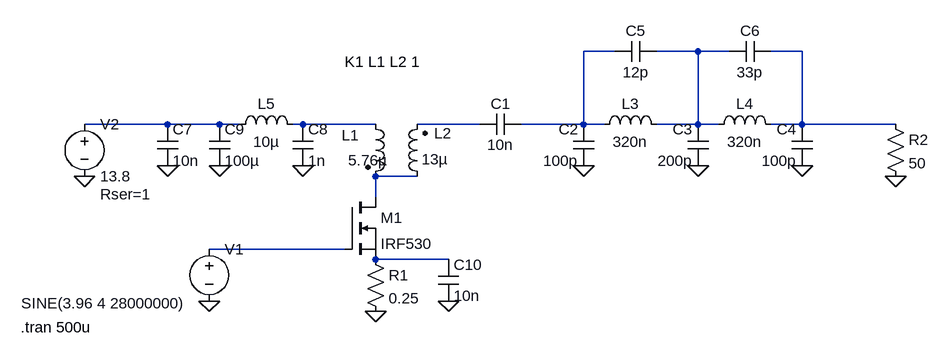
[diagram p0: schematic usdx_mOnO_PA_IRF530.asc]
usdx_mOnO_PA_IRF530.asc, the LTspice schematic file:
Version 4
SHEET 1 1016 680
WIRE 528 -112 480 -112
WIRE 656 -112 592 -112
WIRE 704 -112 656 -112
WIRE 816 -112 768 -112
WIRE -160 0 -288 0
WIRE -80 0 -160 0
WIRE -48 0 -80 0
WIRE 48 0 32 0
WIRE 160 0 48 0
WIRE 320 0 224 0
WIRE 480 0 480 -112
WIRE 480 0 384 0
WIRE 512 0 480 0
WIRE 656 0 656 -112
WIRE 656 0 592 0
WIRE 688 0 656 0
WIRE 816 0 816 -112
WIRE 816 0 768 0
WIRE 960 0 816 0
WIRE 224 80 160 80
WIRE 160 112 160 80
WIRE 112 192 -96 192
WIRE 272 208 160 208
FLAG -96 272 0
FLAG 160 288 0
FLAG -288 80 0
FLAG 480 64 0
FLAG 656 64 0
FLAG 816 64 0
FLAG 960 80 0
FLAG -160 64 0
FLAG 48 64 0
FLAG -80 64 0
FLAG 272 272 0
SYMBOL nmos 112 112 R0
SYMATTR InstName M1
SYMATTR Value IRF530
SYMBOL voltage -96 176 R0
WINDOW 3 -289 99 Left 2
WINDOW 123 0 0 Left 0
WINDOW 39 0 0 Left 0
SYMATTR InstName V1
SYMATTR Value SINE(3.96 4 28000000)
SYMBOL res 144 192 R0
SYMATTR InstName R1
SYMATTR Value 0.25
SYMBOL ind2 144 -16 R0
WINDOW 0 -36 33 Left 2
WINDOW 3 -26 71 Left 2
SYMATTR InstName L1
SYMATTR Value 5.76µ
SYMATTR Type ind
SYMBOL ind2 240 96 R180
WINDOW 0 -37 82 Left 2
WINDOW 3 -31 42 Left 2
SYMATTR InstName L2
SYMATTR Value 13µ
SYMATTR Type ind
SYMBOL voltage -288 -16 R0
WINDOW 123 0 0 Left 0
WINDOW 39 24 124 Left 2
SYMATTR InstName V2
SYMATTR Value 13.8
SYMATTR SpiceLine Rser=1
SYMBOL cap 384 -16 R90
WINDOW 0 0 32 VBottom 2
WINDOW 3 32 32 VTop 2
SYMATTR InstName C1
SYMATTR Value 10n
SYMBOL cap 496 64 R180
WINDOW 0 24 56 Left 2
WINDOW 3 24 8 Left 2
SYMATTR InstName C2
SYMATTR Value 100p
SYMBOL cap 672 64 R180
WINDOW 0 24 56 Left 2
WINDOW 3 24 8 Left 2
SYMATTR InstName C3
SYMATTR Value 200p
SYMBOL cap 832 64 R180
WINDOW 0 24 56 Left 2
WINDOW 3 24 8 Left 2
SYMATTR InstName C4
SYMATTR Value 100p
SYMBOL res 944 -16 R0
SYMATTR InstName R2
SYMATTR Value 50
SYMBOL ind 496 16 R270
WINDOW 0 32 56 VTop 2
WINDOW 3 5 56 VBottom 2
SYMATTR InstName L3
SYMATTR Value 320n
SYMBOL ind 672 16 R270
WINDOW 0 32 56 VTop 2
WINDOW 3 5 56 VBottom 2
SYMATTR InstName L4
SYMATTR Value 320n
SYMBOL cap 592 -128 R90
WINDOW 0 0 32 VBottom 2
WINDOW 3 32 32 VTop 2
SYMATTR InstName C5
SYMATTR Value 12p
SYMBOL cap 768 -128 R90
WINDOW 0 0 32 VBottom 2
WINDOW 3 32 32 VTop 2
SYMATTR InstName C6
SYMATTR Value 33p
SYMBOL cap -176 0 R0
SYMATTR InstName C7
SYMATTR Value 10n
SYMBOL ind -64 16 R270
WINDOW 0 32 56 VTop 2
WINDOW 3 5 56 VBottom 2
SYMATTR InstName L5
SYMATTR Value 10µ
SYMBOL cap 32 0 R0
SYMATTR InstName C8
SYMATTR Value 1n
SYMBOL cap -96 0 R0
SYMATTR InstName C9
SYMATTR Value 100µ
SYMBOL cap 256 208 R0
SYMATTR InstName C10
SYMATTR Value 10n
TEXT 112 -96 Left 2 !K1 L1 L2 1
TEXT -386 312 Left 2 !.tran 500u

The netlist it stands for:
* usdx_mOnO_PA_IRF530.asc
M1 N007 N008 N009 N009 IRF530
V1 N008 0 SINE(3.96 4 28000000)
R1 N009 0 0.25
L1 N005 N007 5.76µ
L2 N007 N006 13µ
V2 N004 0 13.8 Rser=1
C1 N001 N006 10n
C2 0 N001 100p
C3 0 N002 200p
C4 0 N003 100p
R2 N003 0 50
L3 N001 N002 320n
L4 N002 N003 320n
C5 N002 N001 12p
C6 N003 N002 33p
C7 N004 0 10n
L5 N004 N005 10µ
C8 N005 0 1n
C9 N004 0 100µ
C10 N009 0 10n
.model NMOS NMOS
.model PMOS PMOS
.lib standard.mos
K1 L1 L2 1
.tran 500u
.backanno
.end